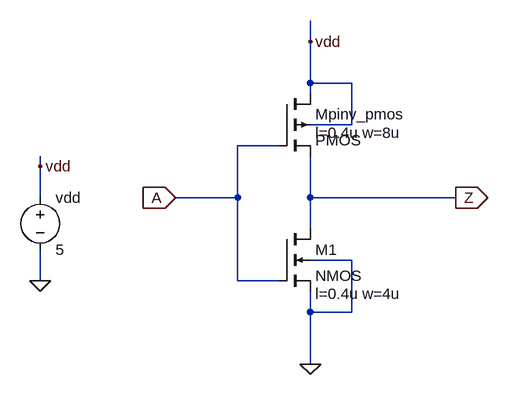
[diagram p0: schematic sram_16x2_pinv_7.asc]
sram_16x2_pinv_7.asc, the LTspice schematic file:
Version 4
SHEET 1 880 680
WIRE 112 -128 112 -160
WIRE 112 -64 112 -128
WIRE 176 -64 112 -64
WIRE 112 -48 112 -64
WIRE 176 0 176 -64
WIRE 176 0 112 0
WIRE 64 32 0 32
WIRE -304 64 -304 48
WIRE -304 112 -304 64
WIRE 0 112 0 32
WIRE 0 112 -96 112
WIRE 112 112 112 48
WIRE 336 112 112 112
WIRE 112 160 112 112
WIRE 176 208 112 208
WIRE -304 240 -304 192
WIRE 0 240 0 112
WIRE 64 240 0 240
WIRE 112 288 112 256
WIRE 176 288 176 208
WIRE 176 288 112 288
WIRE 112 368 112 288
FLAG -96 112 A
IOPIN -96 112 In
FLAG 336 112 Z
IOPIN 336 112 Out
FLAG 112 368 0
FLAG -304 240 0
FLAG 112 -128 vdd
FLAG -304 64 vdd
SYMBOL nmos4 64 160 R0
WINDOW 123 56 100 Left 2
SYMATTR Value2 l=0.4u w=4u
SYMATTR InstName M1
SYMBOL pmos4 64 -48 R0
WINDOW 123 56 60 Left 2
SYMATTR Value2 l=0.4u w=8u
SYMATTR InstName Mpinv_pmos
SYMBOL voltage -304 96 R0
SYMATTR InstName vdd
SYMATTR Value 5

The netlist it stands for:
* sram_16x2_pinv_7.asc
M1 Z A 0 0 NMOS l=0.4u w=4u
Mpinv_pmos vdd A Z vdd PMOS l=0.4u w=8u
vdd vdd 0 5
.model NMOS NMOS
.model PMOS PMOS
.lib standard.mos
.backanno
.end